# Altium project LED_PCB_LONG.PrjPcb
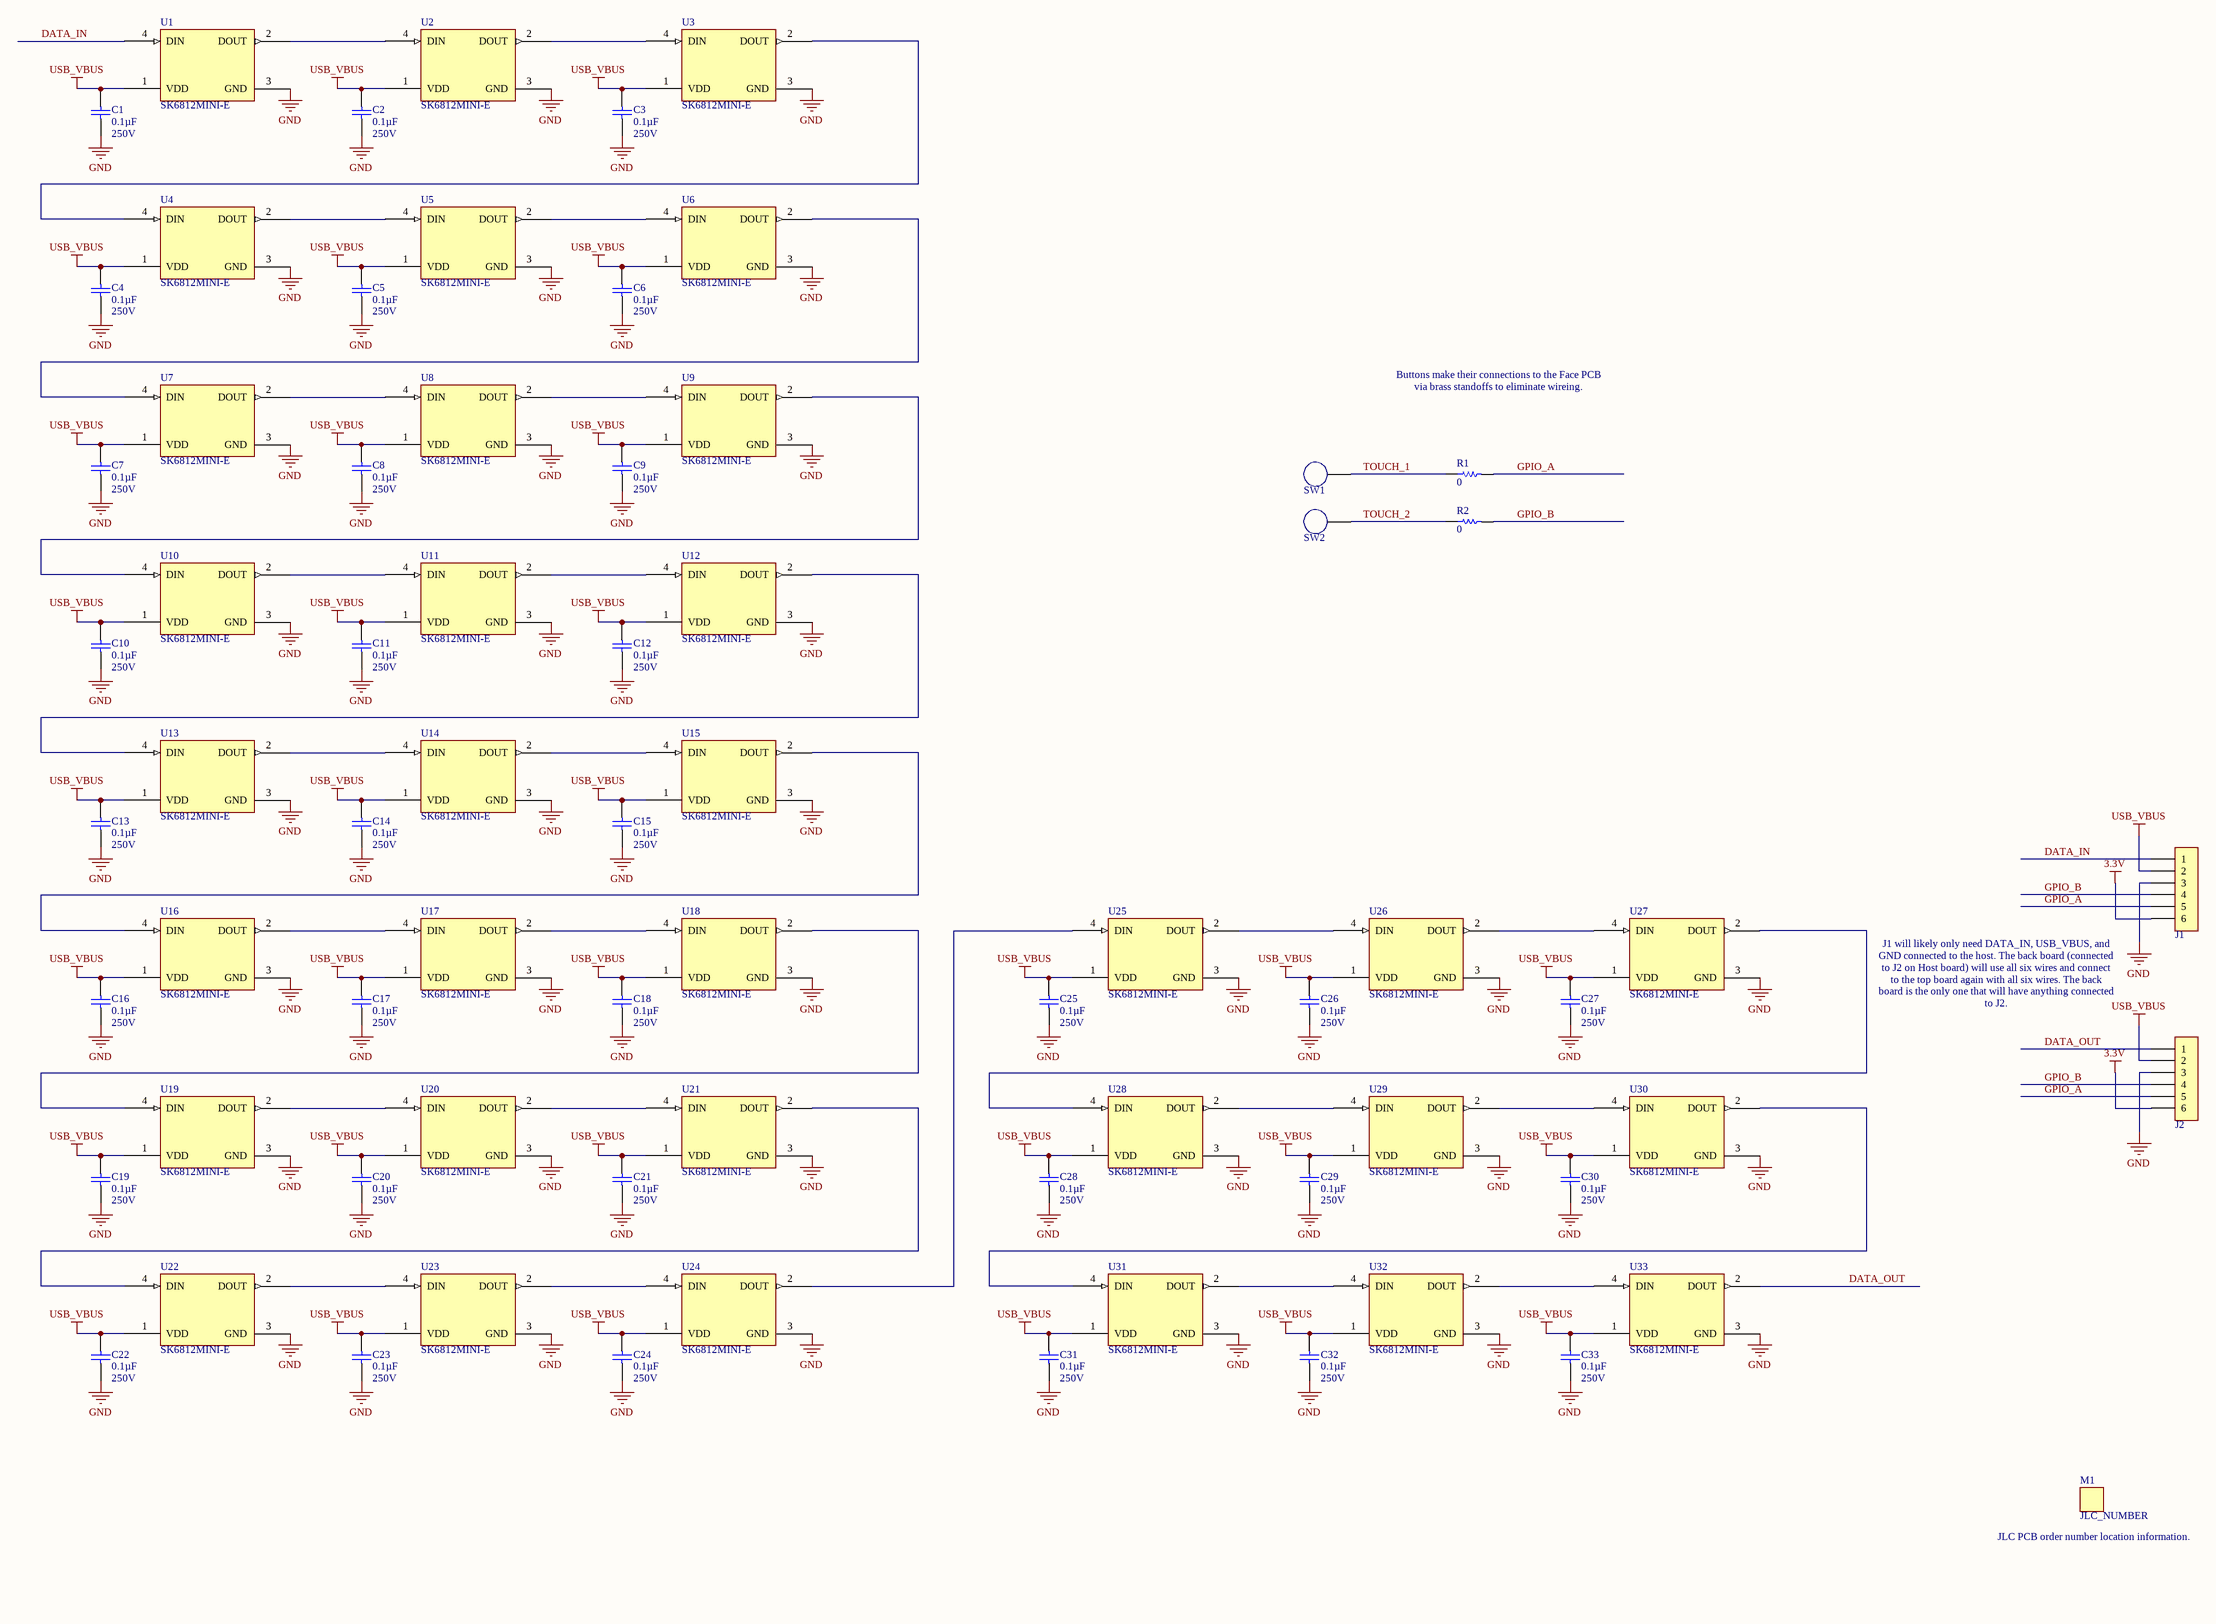
[diagram p0: LED_PCB_LONG.SchDoc]
LeadEngineer: JCF; HardRev: A; Codename: LED_CUBE-LED_BOARD_LONG; BOMRev: A
1 sheet, 73 parts. Net scope: global (net labels, ports and power ports of the same name join across sheets).
Board file: LED_PCB_LONG.PcbDoc

## Sheet LED_PCB_LONG.SchDoc: TITLE GOES HERE
size C; Author: EBK; CompanyName: Vaddio; Organization: Vaddio; Address1: 131 Cheshire Lane; Address2: Minnetonka, MN  55305; Address3: www.vaddio.com; Address4: 800-572-2011; SheetNumber: 1; SheetTotal: 1

### Parts
C1  0.1µF  Voltage: 250V  [Chip0805]
C2  0.1µF  Voltage: 250V  [Chip0805]
C3  0.1µF  Voltage: 250V  [Chip0805]
C4  0.1µF  Voltage: 250V  [Chip0805]
C5  0.1µF  Voltage: 250V  [Chip0805]
C6  0.1µF  Voltage: 250V  [Chip0805]
C7  0.1µF  Voltage: 250V  [Chip0805]
C8  0.1µF  Voltage: 250V  [Chip0805]
C9  0.1µF  Voltage: 250V  [Chip0805]
C10  0.1µF  Voltage: 250V  [Chip0805]
C11  0.1µF  Voltage: 250V  [Chip0805]
C12  0.1µF  Voltage: 250V  [Chip0805]
C13  0.1µF  Voltage: 250V  [Chip0805]
C14  0.1µF  Voltage: 250V  [Chip0805]
C15  0.1µF  Voltage: 250V  [Chip0805]
C16  0.1µF  Voltage: 250V  [Chip0805]
C17  0.1µF  Voltage: 250V  [Chip0805]
C18  0.1µF  Voltage: 250V  [Chip0805]
C19  0.1µF  Voltage: 250V  [Chip0805]
C20  0.1µF  Voltage: 250V  [Chip0805]
C21  0.1µF  Voltage: 250V  [Chip0805]
C22  0.1µF  Voltage: 250V  [Chip0805]
C23  0.1µF  Voltage: 250V  [Chip0805]
C24  0.1µF  Voltage: 250V  [Chip0805]
C25  0.1µF  Voltage: 250V  [Chip0805]
C26  0.1µF  Voltage: 250V  [Chip0805]
C27  0.1µF  Voltage: 250V  [Chip0805]
C28  0.1µF  Voltage: 250V  [Chip0805]
C29  0.1µF  Voltage: 250V  [Chip0805]
C30  0.1µF  Voltage: 250V  [Chip0805]
C31  0.1µF  Voltage: 250V  [Chip0805]
C32  0.1µF  Voltage: 250V  [Chip0805]
C33  0.1µF  Voltage: 250V  [Chip0805]
J1  HEADER_1x6_NO_BOM  [HEADER_1x6_100mil_NP]  (value not drawn)  (no BOM)
J2  HEADER_1x6_NO_BOM  [HEADER_1x6_100mil_NP]  (value not drawn)  (no BOM)
M1  JLC_NUMBER  [JLC_NUMBER]  (no BOM)
R1  0  [Chip0805]
R2  0  [Chip0805]
SW1  TOUCH_PAD_NO_BOM  [TENTED_PAD_5mil]  (value not drawn)  (no BOM)
SW2  TOUCH_PAD_NO_BOM  [TENTED_PAD_5mil]  (value not drawn)  (no BOM)
U1  SK6812MINI-E  [SK6812MINI-E]
U2  SK6812MINI-E  [SK6812MINI-E]
U3  SK6812MINI-E  [SK6812MINI-E]
U4  SK6812MINI-E  [SK6812MINI-E]
U5  SK6812MINI-E  [SK6812MINI-E]
U6  SK6812MINI-E  [SK6812MINI-E]
U7  SK6812MINI-E  [SK6812MINI-E]
U8  SK6812MINI-E  [SK6812MINI-E]
U9  SK6812MINI-E  [SK6812MINI-E]
U10  SK6812MINI-E  [SK6812MINI-E]
U11  SK6812MINI-E  [SK6812MINI-E]
U12  SK6812MINI-E  [SK6812MINI-E]
U13  SK6812MINI-E  [SK6812MINI-E]
U14  SK6812MINI-E  [SK6812MINI-E]
U15  SK6812MINI-E  [SK6812MINI-E]
U16  SK6812MINI-E  [SK6812MINI-E]
U17  SK6812MINI-E  [SK6812MINI-E]
U18  SK6812MINI-E  [SK6812MINI-E]
U19  SK6812MINI-E  [SK6812MINI-E]
U20  SK6812MINI-E  [SK6812MINI-E]
U21  SK6812MINI-E  [SK6812MINI-E]
U22  SK6812MINI-E  [SK6812MINI-E]
U23  SK6812MINI-E  [SK6812MINI-E]
U24  SK6812MINI-E  [SK6812MINI-E]
U25  SK6812MINI-E  [SK6812MINI-E]
U26  SK6812MINI-E  [SK6812MINI-E]
U27  SK6812MINI-E  [SK6812MINI-E]
U28  SK6812MINI-E  [SK6812MINI-E]
U29  SK6812MINI-E  [SK6812MINI-E]
U30  SK6812MINI-E  [SK6812MINI-E]
U31  SK6812MINI-E  [SK6812MINI-E]
U32  SK6812MINI-E  [SK6812MINI-E]
U33  SK6812MINI-E  [SK6812MINI-E]

### Nets
3.3V: J1.6 J2.6
GND: C1.1 C2.1 C3.1 C4.1 C5.1 C6.1 C7.1 C8.1 C9.1 C10.1 C11.1 C12.1 C13.1 C14.1 C15.1 C16.1 C17.1 C18.1 C19.1 C20.1 C21.1 C22.1 C23.1 C24.1 C25.1 C26.1 C27.1 C28.1 C29.1 C30.1 C31.1 C32.1 C33.1 J1.3 J2.3 U1.3(GND) U2.3(GND) U3.3(GND) U4.3(GND) U5.3(GND) U6.3(GND) U7.3(GND) U8.3(GND) U9.3(GND) U10.3(GND) U11.3(GND) U12.3(GND) U13.3(GND) U14.3(GND) U15.3(GND) U16.3(GND) U17.3(GND) U18.3(GND) U19.3(GND) U20.3(GND) U21.3(GND) U22.3(GND) U23.3(GND) U24.3(GND) U25.3(GND) U26.3(GND) U27.3(GND) U28.3(GND) U29.3(GND) U30.3(GND) U31.3(GND) U32.3(GND) U33.3(GND)
USB_VBUS: C1.2 C2.2 C3.2 C4.2 C5.2 C6.2 C7.2 C8.2 C9.2 C10.2 C11.2 C12.2 C13.2 C14.2 C15.2 C16.2 C17.2 C18.2 C19.2 C20.2 C21.2 C22.2 C23.2 C24.2 C25.2 C26.2 C27.2 C28.2 C29.2 C30.2 C31.2 C32.2 C33.2 J1.2 J2.2 U1.1(VDD) U2.1(VDD) U3.1(VDD) U4.1(VDD) U5.1(VDD) U6.1(VDD) U7.1(VDD) U8.1(VDD) U9.1(VDD) U10.1(VDD) U11.1(VDD) U12.1(VDD) U13.1(VDD) U14.1(VDD) U15.1(VDD) U16.1(VDD) U17.1(VDD) U18.1(VDD) U19.1(VDD) U20.1(VDD) U21.1(VDD) U22.1(VDD) U23.1(VDD) U24.1(VDD) U25.1(VDD) U26.1(VDD) U27.1(VDD) U28.1(VDD) U29.1(VDD) U30.1(VDD) U31.1(VDD) U32.1(VDD) U33.1(VDD)
DATA_IN: J1.1 U1.4(DIN)
DATA_OUT: J2.1 U33.2(DOUT)
GPIO_A: J1.5 J2.5 R1.2
GPIO_B: J1.4 J2.4 R2.2
TOUCH_1: R1.1 SW1.1
TOUCH_2: R2.1 SW2.1
NetU1_2: U1.2(DOUT) U2.4(DIN)
NetU2_2: U2.2(DOUT) U3.4(DIN)
NetU3_2: U3.2(DOUT) U4.4(DIN)
NetU4_2: U4.2(DOUT) U5.4(DIN)
NetU5_2: U5.2(DOUT) U6.4(DIN)
NetU6_2: U6.2(DOUT) U7.4(DIN)
NetU7_2: U7.2(DOUT) U8.4(DIN)
NetU8_2: U8.2(DOUT) U9.4(DIN)
NetU9_2: U9.2(DOUT) U10.4(DIN)
NetU10_2: U10.2(DOUT) U11.4(DIN)
NetU11_2: U11.2(DOUT) U12.4(DIN)
NetU12_2: U12.2(DOUT) U13.4(DIN)
NetU13_2: U13.2(DOUT) U14.4(DIN)
NetU14_2: U14.2(DOUT) U15.4(DIN)
NetU15_2: U15.2(DOUT) U16.4(DIN)
NetU16_2: U16.2(DOUT) U17.4(DIN)
NetU17_2: U17.2(DOUT) U18.4(DIN)
NetU18_2: U18.2(DOUT) U19.4(DIN)
NetU19_2: U19.2(DOUT) U20.4(DIN)
NetU20_2: U20.2(DOUT) U21.4(DIN)
NetU21_2: U21.2(DOUT) U22.4(DIN)
NetU22_2: U22.2(DOUT) U23.4(DIN)
NetU23_2: U23.2(DOUT) U24.4(DIN)
NetU24_2: U24.2(DOUT) U25.4(DIN)
NetU25_2: U25.2(DOUT) U26.4(DIN)
NetU26_2: U26.2(DOUT) U27.4(DIN)
NetU27_2: U27.2(DOUT) U28.4(DIN)
NetU28_2: U28.2(DOUT) U29.4(DIN)
NetU29_2: U29.2(DOUT) U30.4(DIN)
NetU30_2: U30.2(DOUT) U31.4(DIN)
NetU31_2: U31.2(DOUT) U32.4(DIN)
NetU32_2: U32.2(DOUT) U33.4(DIN)

### Notes on the sheet
- Buttons make their connections to the Face PCB via brass standoffs to eliminate wireing.
- J1 will likely only need DATA_IN, USB_VBUS, and GND connected to the host. The back board (connected to J2 on Host board) will use all six wires and connect to the top board again with all six wires. The back board is the only one that will have anything connected to J2.
- (near M1) JLC PCB order number location information.
- Title:
- This work is licensed under a Creative Commons Attribution 4.0 International License. Derivative works should remove all Sophistry branding and ‘é’ watermark.
- Date:
- Engineer:
- Revision:
- Codename:
- Time:
- Variant:
- Sheet
- of

### Library data of the parts
C1-C33 = C2012X7T2E104K125AA: CAP CER 0.1UF 250V 10% X7T 0805; Manufacturer: TDK Corporation; PartNumber: C2012X7T2E104K125AA; HelpURL: http://product.tdk.com/capacitor/mlcc/en/documents/mlcc_commercial_midvoltage_en.pdf; Supplier 1: Digi-Key; Supplier Part Number 1: 445-7749-1-ND; Supplier 2: Mouser; Manufacturer Part Number: C2012X7T2E104K125AA; Series: C; Capacitance: 0.1µF; Tolerance: ±10%; Temperature Coefficient: X7T; Mounting Type: Surface Mount, MLCC; Operating Temperature: -55°C ~ 125°C; Applications: General Purpose; Ratings: -; Package / Case: 0805 (2012 Metric); Size / Dimension: 0.079" L x 0.049" W (2.00mm x 1.25mm); Height - Seated (Max): -; Thickness (Max): 0.057" (1.45mm); Lead Spacing: -; Features: -; Lead Style: -
M1 = JLC_NUMBER: JLC Order Number Location; PartNumber: JLC_NUMBER; Manufacturer Part Number: JLC_NUMBER
R1 R2 = CRCW08050000Z0EA: RES 0.0 OHM 1/8W JUMP 0805 SMD; Manufacturer: Vishay Dale; Tolerance: Jumper; Power (Watts): 0.125W, 1/8W; PartNumber: CRCW08050000Z0EA; HelpURL: http://www.vishay.com/doc?20035; Supplier 1: Digi-Key; Supplier Part Number 1: 541-0.0ACT-ND; Supplier 2: Mouser; Manufacturer Part Number: CRCW08050000Z0EA; Series: CRCW; Resistance: 0; Composition: Thick Film; Features: Automotive AEC-Q200 Qualified; Temperature Coefficient: -; Package / Case: 0805 (2012 Metric); Supplier Device Package: 0805 (2012 Metric); Size / Dimension: 0.079" L x 0.049" W (2.00mm x 1.25mm); Height: 0.020" (0.50mm); Number of Terminations: 2
U1-U33 = SK6812MINI-E: Addressable RGB LED; Manufacturer: Adafruit Industries LLC; PartNumber: SK6812MINI-E; Datasheets: https://cdn-shop.adafruit.com/product-files/4960/4960_SK6812MINI-E_REV02_EN.pdf; Supplier 1: Digi-Key; Supplier Part Number 1: 1528-4960-ND; Manufacturer Part Number: SK6812MINI-E
J1 J2 = HEADER_1x6_NO_BOM: PartNumber: HEADER_1x6_NO_BOM; Manufacturer Part Number: HEADER_1x6_NO_BOM
SW1 SW2 = TOUCH_PAD_NO_BOM: PartNumber: TOUCH_PAD_NO_BOM; Manufacturer Part Number: TOUCH_PAD_NO_BOM

## Assembly variants
Recommended Build: not fitted C10 R1 R2 R3 R4 R5 R6 R7 U10